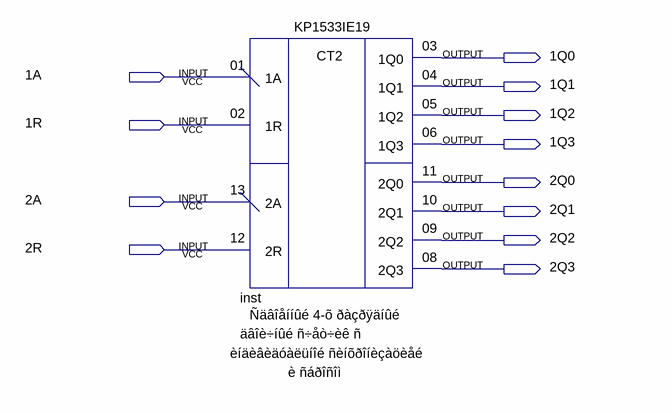
[diagram p0: schematic sheet]
// Quartus schematic 1111.bdf as structural Verilog: 1 symbols, 12 pins
module \1111  (
  input  \1A ,
  input  \1R ,
  input  \2A ,
  input  \2R ,
  output \1Q0 ,
  output \1Q1 ,
  output \1Q2 ,
  output \1Q3 ,
  output \2Q0 ,
  output \2Q1 ,
  output \2Q2 ,
  output \2Q3 
);

  KP1533IE19 inst (
    .\1A (\1A ), .\1R (\1R ), .\2A (\2A ), .\2R (\2R ), .\1Q0 (\1Q0 ), .\1Q1 (\1Q1 ), .\1Q2 (\1Q2 ),
    .\1Q3 (\1Q3 ), .\2Q0 (\2Q0 ), .\2Q1 (\2Q1 ), .\2Q2 (\2Q2 ), .\2Q3 (\2Q3 ));
endmodule
